# EAGLE design tj208 EL311 (EAGLE 9.5.2)
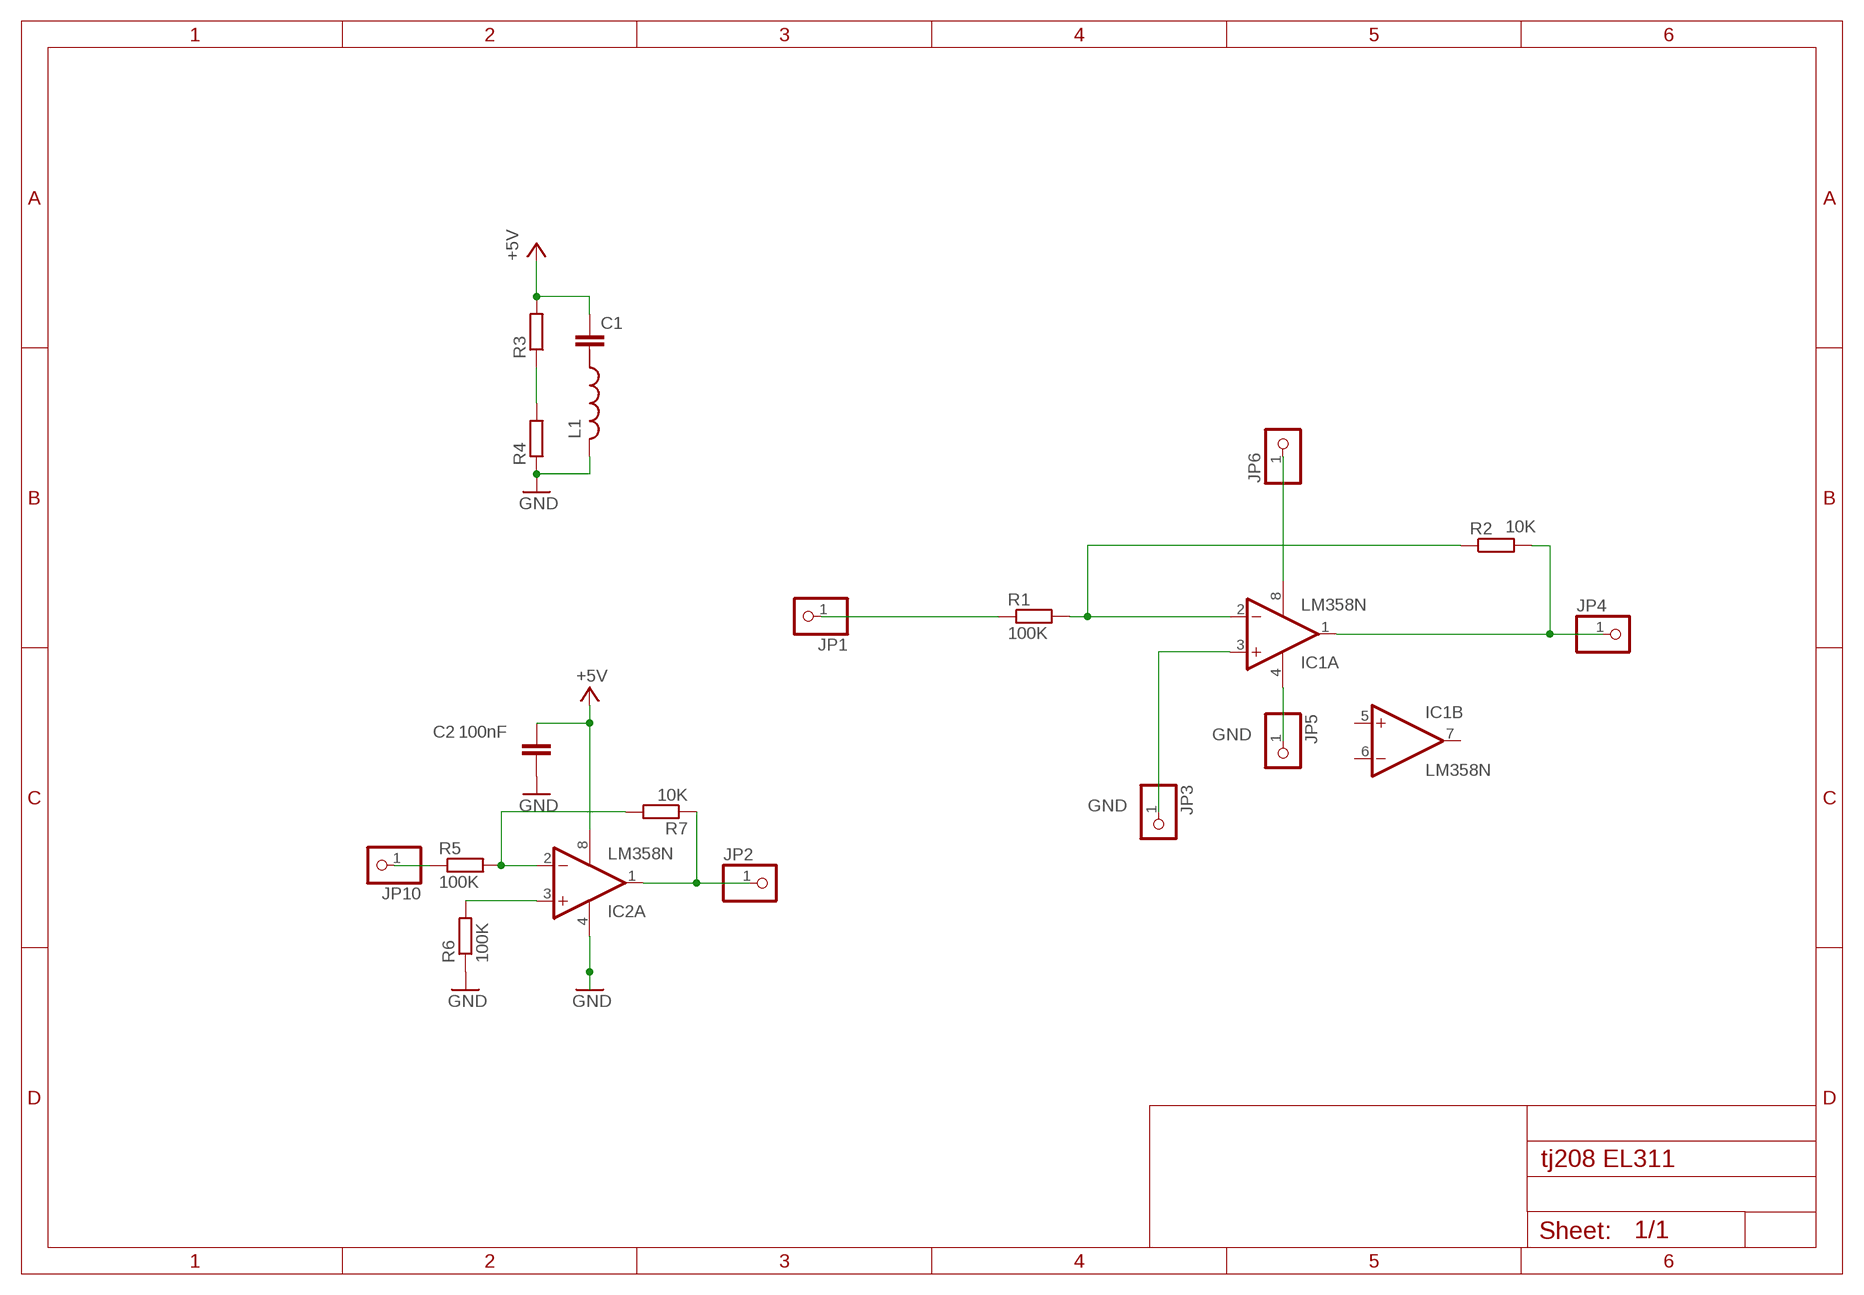
[diagram p0: schematic, sheet 1]

## Parts
C1  C-EU025-024X044  [C025-024X044]
C2  100nF  C-EU025-024X044  [C025-024X044]
IC1  LM358N  [DIL08]
IC2  LM358N  [DIL08]
JP1  PINHD-1X1  [1X01]
JP2  PINHD-1X1  [1X01]
JP3  PINHD-1X1  [1X01]
JP4  PINHD-1X1  [1X01]
JP5  PINHD-1X1  [1X01]
JP6  PINHD-1X1  [1X01]
JP10  PINHD-1X1  [1X01]
L1  L-US0204/5  [0204/5]
R1  100K  R-EU_0207/10  [0207/10]
R2  10K  R-EU_0207/10  [0207/10]
R3  R-EU_0207/5V  [0207/5V]
R4  R-EU_0207/5V  [0207/5V]
R5  100K  R-EU_0207/10  [0207/10]
R6  100K  R-EU_0207/5V  [0207/5V]
R7  10K  R-EU_0207/5V  [0207/5V]

## Nets
GND: C2.2 IC1.3(A:+IN) IC1.4(P:V-) IC2.3(A:+IN) IC2.4(P:V-) JP3.1 JP5.1 L1.2 R4.1 R6.1 R6.2
N$1: JP1.1 R1.1
N$2: IC1.2(A:-IN) R1.2 R2.1
N$3: IC1.8(P:V+) JP6.1
N$4: R3.1 R4.2
N$5: IC2.1(A:OUT) JP2.1 R7.1
N$6: IC1.1(A:OUT) JP4.1 R2.2
N$7: IC2.2(A:-IN) R5.2 R7.2
N$11: JP10.1 R5.1
VCC: C1.1 C2.1 IC2.8(P:V+) R3.2 ; supply symbol labelled +5V
Unconnected: C1.2 IC1.5(B:+IN) IC1.6(B:-IN) IC1.7(B:OUT) IC2.5(B:+IN) IC2.6(B:-IN) IC2.7(B:OUT) L1.1

## Library data of the parts
C1 C2 = rcl:C-EU: CAPACITOR, European symbol; SPICEPREFIX: C
IC1 IC2 = linear:LM358: OP AMP also LM158; LM258; LM2904 Source: http://cache.national.com/ds/LM/LM158.pdf
JP1-JP6 JP10 = pinhead:PINHD-1X1: PIN HEADER
L1 = rcl:L-US: INDUCTOR, American symbol; SPICEPREFIX: L
R1-R7 = rcl:R-EU_: RESISTOR, European symbol; SPICEPREFIX: R

## Net classes
0 default: width 0.305 mm

## Board
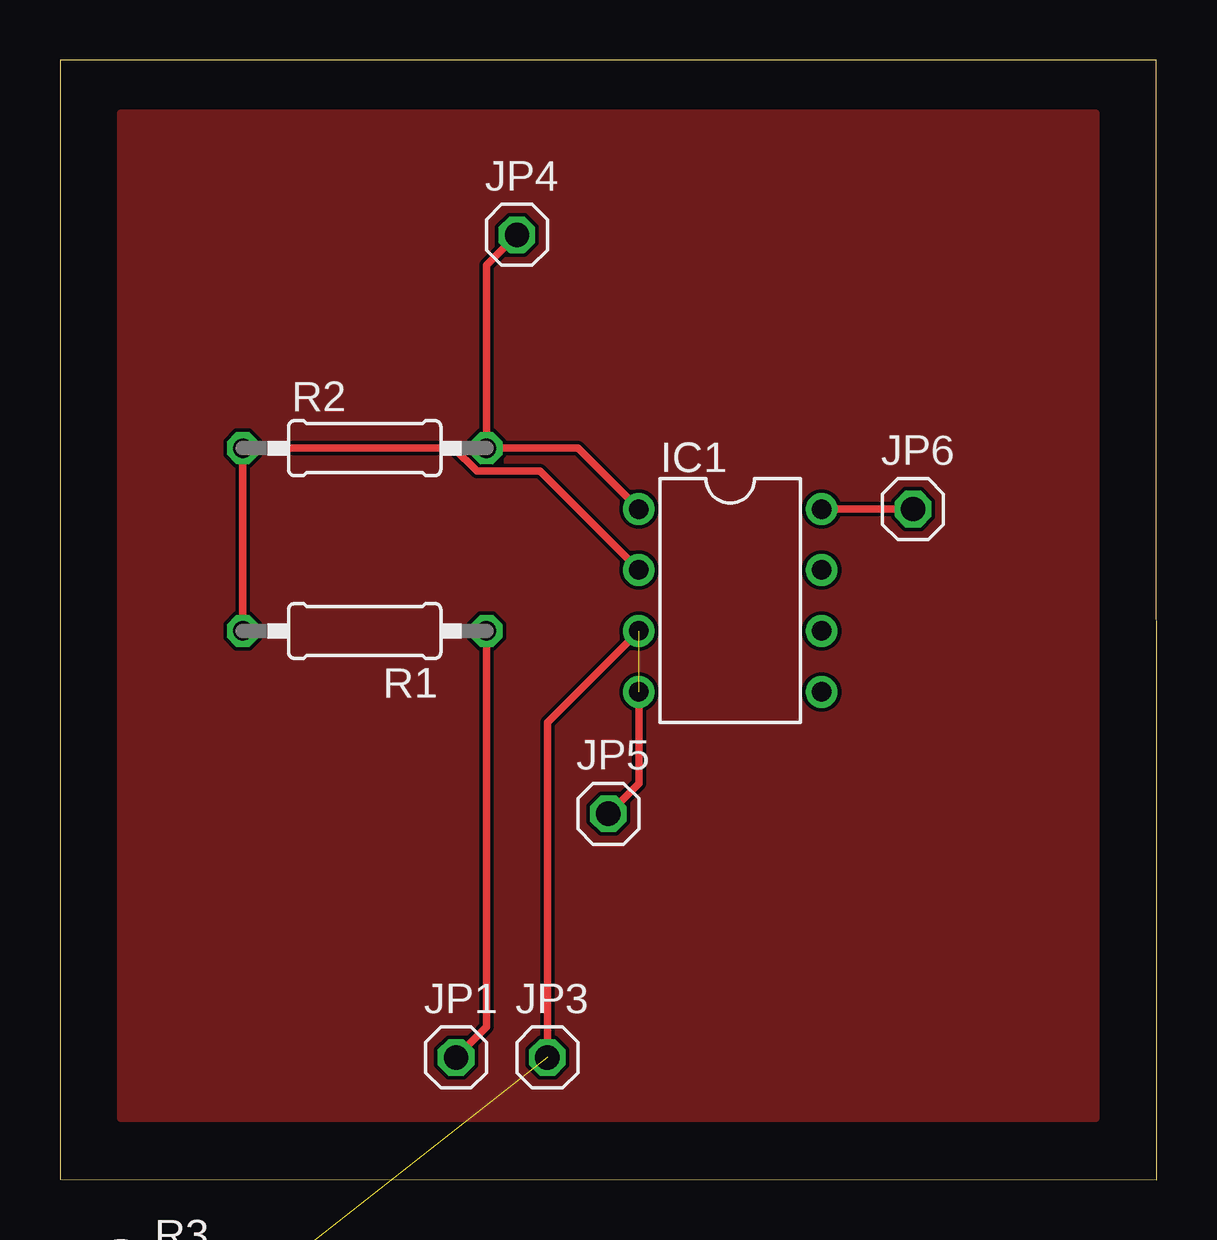
[diagram p1: board, top side]

Size 45.72 x 46.68 mm. Coordinates in mm from the lower left corner, seen from the top.
Outline: 0,0.02 45.72,0 45.7,46.68 0,46.68 0,0.02
Copper layers (1*16): Top 0.035mm / dielectric 1.5mm / Bottom 0.035mm
Design rules "default": minimum track width 6mil, minimum drill 0.35mm, track to track 6mil, track to pad 6mil, pad to pad 6mil, via to via 6mil, smd to smd 6mil, copper to edge 40mil, drill to drill 6mil, minimum pad ring 10mil, minimum via ring 8mil, stop-mask expansion 4mil, vias tented up to drill 0mil, thermal gap 10mil

### Footprints (pad centres in the part's own frame; a part is rotated, then mirrored left to right if it is on the bottom)
C025-024X044 = drill 0.813 octagon: 1 -1.27,0; 2 1.27,0
DIL08 = drill 0.813 pad 1.27: 1 -3.81,-3.81; 2 -1.27,-3.81; 3 1.27,-3.81; 4 3.81,-3.81; 5 3.81,3.81; 6 1.27,3.81; 7 -1.27,3.81; 8 -3.81,3.81
1X01 = drill 1.016 octagon: 1 0,0
0204/5 = drill 0.813 octagon: 1 -2.54,0; 2 2.54,0
0207/10 = drill 0.813 octagon: 1 -5.08,0; 2 5.08,0
0207/5V = drill 0.813 octagon: 1 -2.54,0; 2 2.54,0

### Placement (x,y rotation side)
C1  2.54,-13.95 0 top  (outside the outline)
C2  2.54,-59.67 0 top  (outside the outline)
IC1  27.94,24.15 270 top
IC2  7.62,-25.38 0 top  (outside the outline)
JP1  16.51,5.1 0 top
JP2  2.54,-44.43 0 top  (outside the outline)
JP3  20.32,5.1 0 top
JP4  19.05,39.39 0 top
JP5  22.86,15.26 0 top
JP6  35.56,27.96 0 top
JP10  15.24,-24.11 0 top  (outside the outline)
L1  3.81,-19.03 0 top  (outside the outline)
R1  12.7,22.88 180 top
R2  12.7,30.5 0 top
R3  5.08,-3.79 0 top  (outside the outline)
R4  5.08,-8.87 0 top  (outside the outline)
R5  11.43,-39.35 0 top  (outside the outline)
R6  5.08,-49.51 0 top  (outside the outline)
R7  5.08,-54.59 0 top  (outside the outline)

### Tracks (layer width: path | path; a pad name or v marks a point on that pad's centre or on a via)
COOPER
  pour Top: 2.54,2.56 43.18,2.56 43.18,44.47 2.54,44.47
GND  (8 unrouted)
  Top 0.305: IC1.3 20.32,19.07 JP3.1 | IC1.4 24.13,16.53 JP5.1
N$1
  Top 0.305: R1.1 17.78,6.37 JP1.1
N$2
  Top 0.305: R1.2 R2.1 16.41,30.5 17.38,29.54 20.02,29.54 IC1.2
N$3
  Top 0.305: JP6.1 IC1.8
N$4  (1 unrouted)
N$5  (2 unrouted)
N$6
  Top 0.305: IC1.1 21.59,30.5 R2.2 17.78,38.12 JP4.1
N$7  (2 unrouted)
N$11  (1 unrouted)
VCC  (3 unrouted)